# Altium schematic sheet bus-main.SchDoc
size A4
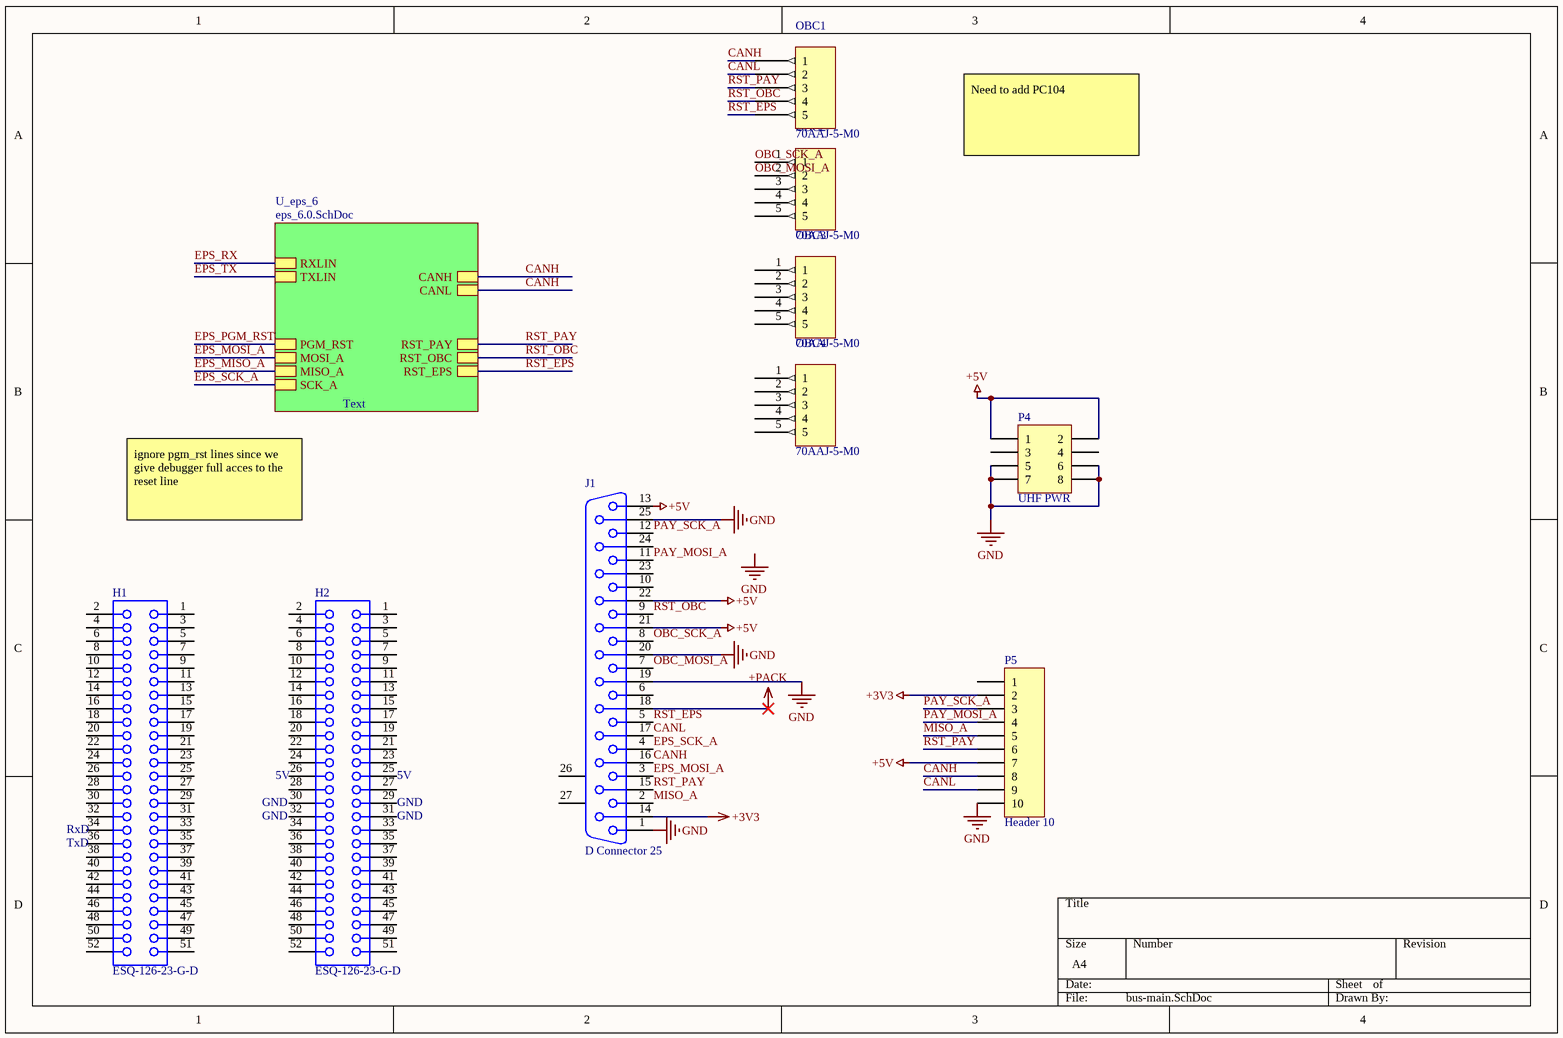
[diagram p0: bus-main.SchDoc]

## Parts
H1  ESQ-126-23-G-D  [SMTC-ESQ-126-23-X-D]
H2  ESQ-126-23-G-D  [SMTC-ESQ-126-23-X-D]
J1  D Connector 25  [Mini DSub Connector]
OBC1  70AAJ-5-M0
OBC2  70AAJ-5-M0
OBC3  70AAJ-5-M0
OBC4  70AAJ-5-M0
P4  UHF PWR  [HDR2X4]
P5  Header 10  [DF14-10P-1.25H(55) - duplicate]

## Sub-sheets
U_eps_6 = eps_6.0.SchDoc: RXLIN, TXLIN, RST_PAY, RST_OBC, RST_EPS, SCK_A, PGM_RST, MOSI_A, MISO_A, CANL, CANH

## Nets
+3V3: J1.14 P5.2
+5V: J1.13 J1.21 J1.22 P4.1 P4.2 P5.7
+PACK: J1.18
GND: J1.1 J1.19 J1.20 J1.25 P4.5 P4.6 P4.7 P4.8 P5.10
CANH: J1.16 OBC1.1 P5.8 ; sheet U_eps_6/CANL, sheet U_eps_6/CANH
CANL: J1.17 OBC1.2 P5.9
EPS_MISO_A: sheet U_eps_6/MISO_A
EPS_MOSI_A: J1.3 ; sheet U_eps_6/MOSI_A
EPS_PGM_RST: sheet U_eps_6/PGM_RST
EPS_RX: sheet U_eps_6/RXLIN
EPS_SCK_A: J1.4 ; sheet U_eps_6/SCK_A
EPS_TX: sheet U_eps_6/TXLIN
MISO_A: J1.2 P5.5
OBC_MOSI_A: J1.7 OBC2.2
OBC_SCK_A: J1.8 OBC2.1
PAY_MOSI_A: J1.11 P5.4
PAY_SCK_A: J1.12 P5.3
RST_EPS: J1.5 OBC1.5 ; sheet U_eps_6/RST_EPS
RST_OBC: J1.9 OBC1.4 ; sheet U_eps_6/RST_OBC
RST_PAY: J1.15 OBC1.3 P5.6 ; sheet U_eps_6/RST_PAY

Not connected (* = marked no-connect by the designer): H1 1 2 3 4 5 6 7 8 9 10 11 12 13 14 15 16 17 18 19 20 21 22 23 24 25 26 27 28 29 30 31 32 33 34 35 36 37 38 39 40 41 42 43 44 45 46 47 48 49 50 51 52; H2 1 2 3 4 5 6 7 8 9 10 11 12 13 14 15 16 17 18 19 20 21 22 23 24 25 26 27 28 29 30 31 32 33 34 35 36 37 38 39 40 41 42 43 44 45 46 47 48 49 50 51 52; J1 6 10 23 24 26(MH1) 27(MH2); OBC2 3 4 5; OBC3 1 2 3 4 5; OBC4 1 2 3 4 5; P4 3 4; P5 1

## Notes on the sheet
- Need to add PC104
- Text
- ignore pgm_rst lines since we give debugger full acces to the reset line
- (near H2) 5V
- (near H1) RxD
- (near H1) TxD
- (near H2) GND
- Labels drawn without touching a wire or pin: GND

## Library data of the parts
H1 H2 = ESQ-126-23-G-D: PC/104(TM) Elevated Socket Strip, Through-hole, Vertical, -55 to 125 degC, 2.54 mm Pitch, 52-Pin, Female, RoHS; Manufacturer: Samtec; Pitch: 2.54 mm; DatasheetVersion: F-214; PackageVersion: BZ, 9/1998; PackageReference: ESQ-126-23-X-D; PackageDescription: ESQ Strip ASM; Supplier 1: Newark; Supplier Part Number 1: 92P1348; Orientation: Vertical; RoHS: True; Temperature Range: -55 to 125 degC; Mounting Technology: Through-hole; PartNumber: ESQ-126-23-G-D; ComponentLink1Description: Manufacturer URL; ComponentLink1URL: http://www.samtec.com; ComponentLink2Description: Datasheet; ComponentLink2URL: http://www.samtec.com/documents/webfiles/pdf/ESQ_TH.PDF; ComponentLink3Description: Package Specification; ComponentLink3URL: http://www.samtec.com/documents/webfiles/cpdf/ESQ-1XX-XX-X-X-XXX-XX-X-XX-MKT.pdf
J1 = D Connector 25: Receptacle Assembly, 25 Position, Right Angle; PackageDocument: U; Positions: 25; Published: 15-Jun-2001; LatestRevisionDate: 17-Jul-2002; LatestRevisionNote: Re-released for DXP Platform.; DatasheetDocument: 19-Mar-1999; PackageReference: 787202; Publisher: Altium Limited; Orientation: Right Angle; Gender: Receptacle; ComponentLink1Description: Mini-D25 - Molex, LLC 0836149012; ComponentLink1URL: https://www.digikey.ca/product-detail/en/molex-llc/0836149012/WM2144-ND/1867000
P4 = Header 4X2: Header, 4-Pin, Dual row; LatestRevisionDate: 17-Jul-2002; LatestRevisionNote: Re-released for DXP Platform.; Publisher: Altium Limited
P5 = Header 10: Header, 10-Pin; LatestRevisionDate: 17-Jul-2002; LatestRevisionNote: Re-released for DXP Platform.; Publisher: Altium Limited